# EAGLE schematic FLC100_level_shifting_cloud (EAGLE 6.4)
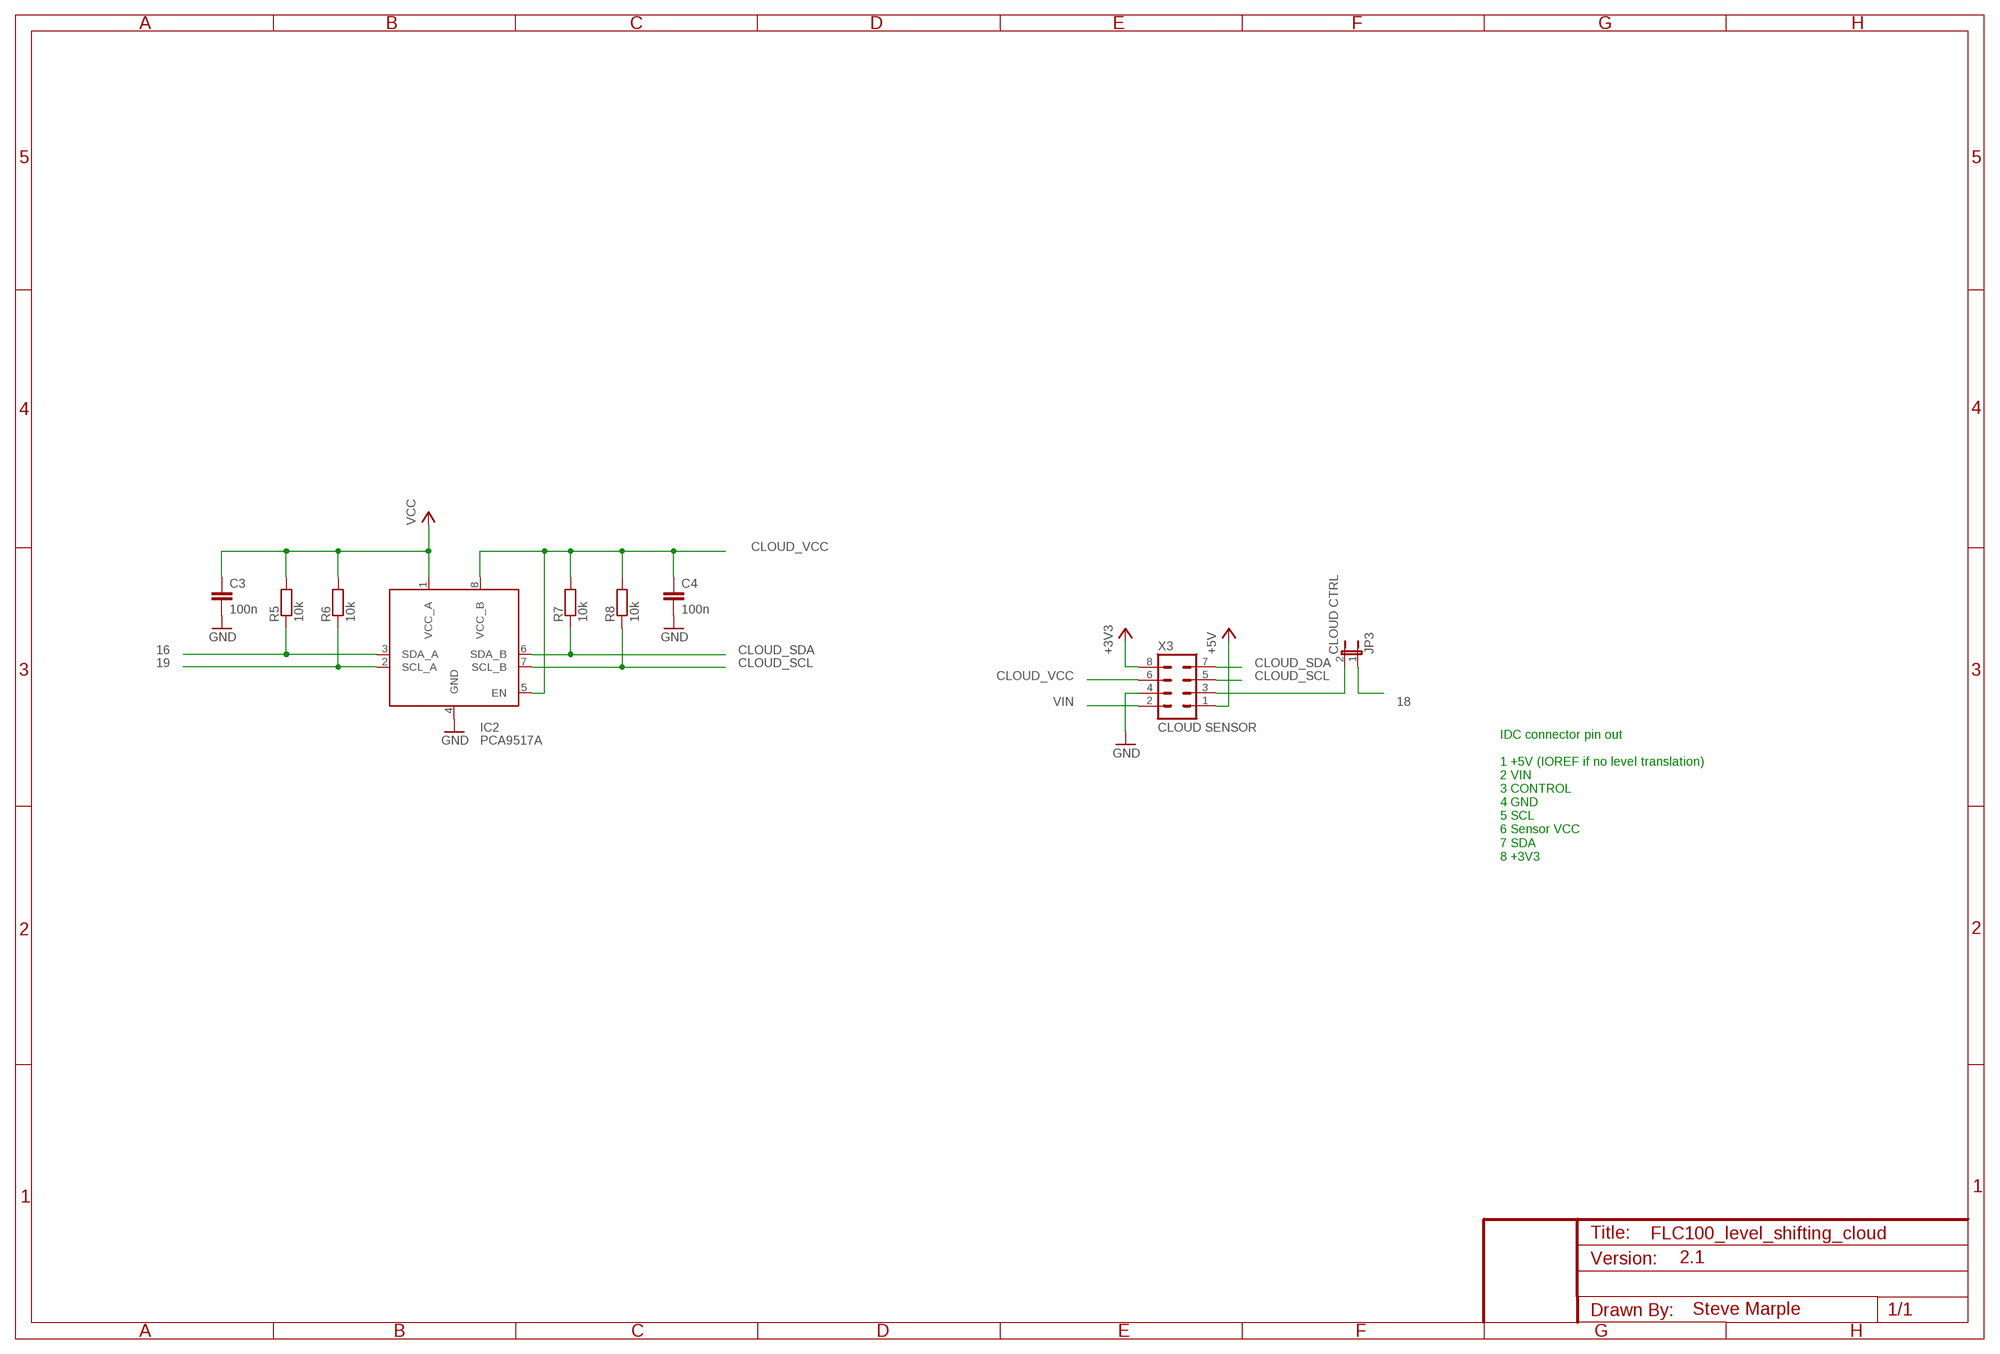
[diagram p0: schematic, sheet 1]

## Parts
C3  100n  C-EU1206-HAND  [1206-HAND]
C4  100n  C-EU1206-HAND  [1206-HAND]
IC2  PCA9517A  PCA9517ASOIC  [SO08]
JP3  CLOUD CTRL  JUMPER-2PTH  [1X02]
R5  10k  RESISTOR1206-HAND  [1206-HAND]
R6  10k  RESISTOR1206-HAND  [1206-HAND]
R7  10k  RESISTOR1206-HAND  [1206-HAND]
R8  10k  RESISTOR1206-HAND  [1206-HAND]
X3  CLOUD SENSOR  ML8  [ML8]

## Nets
16: IC2.3(SDA_A) R5.1
18: JP3.1
19: IC2.2(SCL_A) R6.1
+3V3 [power]: X3.8
+5V [power]: X3.1
CLOUD_SCL: IC2.7(SCL_B) R8.1 X3.5
CLOUD_SDA: IC2.6(SDA_B) R7.1 X3.7
CLOUD_VCC: C4.1 IC2.5(EN) IC2.8(VCC_B) R7.2 R8.2 X3.6
GND [power]: C3.2 C4.2 IC2.4(GND) X3.4
N$3: JP3.2 X3.3
VCC [power]: C3.1 IC2.1(VCC_A) R5.2 R6.2
VIN [power]: X3.2

## Notes on the sheet
- IDC connector pin out
  
  1 +5V (IOREF if no level translation)
  2 VIN
  3 CONTROL
  4 GND
  5 SCL
  6 Sensor VCC
  7 SDA
  8 +3V3
- 2.1
- Steve Marple

## Library data of the parts
C3 C4 = SteveMarple:C-EU
IC2 = SteveMarple:PCA9517A
JP3 = SparkFun:JUMPER-2: Jumper Basic 0.1" spaced jumper. Use with breakaway headers.
R5-R8 = SteveMarple:RESISTOR: 1/4W PTH resistor
X3 = SteveMarple:ML8

## Net classes
1 power: width 0.381 mm
2 antenna: width 0.381 mm